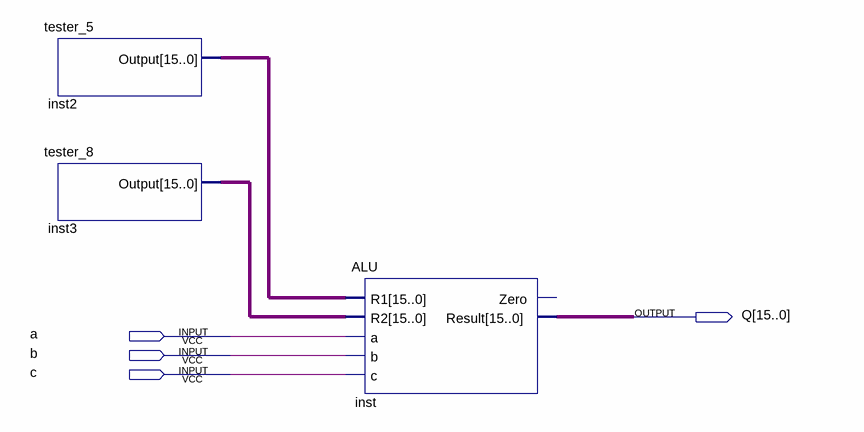
[diagram p0: schematic sheet]
// Quartus schematic test_ALE.bdf as structural Verilog: 3 symbols, 4 pins
module test_ALE (
  input  a,
  input  b,
  input  c,
  output [15:0] Q
);

  wire [15:0] inst2_output, inst3_output;

  tester_5 inst2 (.Output(inst2_output));
  tester_8 inst3 (.Output(inst3_output));
  ALU inst (.R1(inst2_output), .R2(inst3_output), .a(a), .b(b), .c(c), .Result(Q));  // open: Zero
endmodule
